# EAGLE schematic BT840_1.25mm_headers (EAGLE 9.6.2)

## Sheet 1 of 3
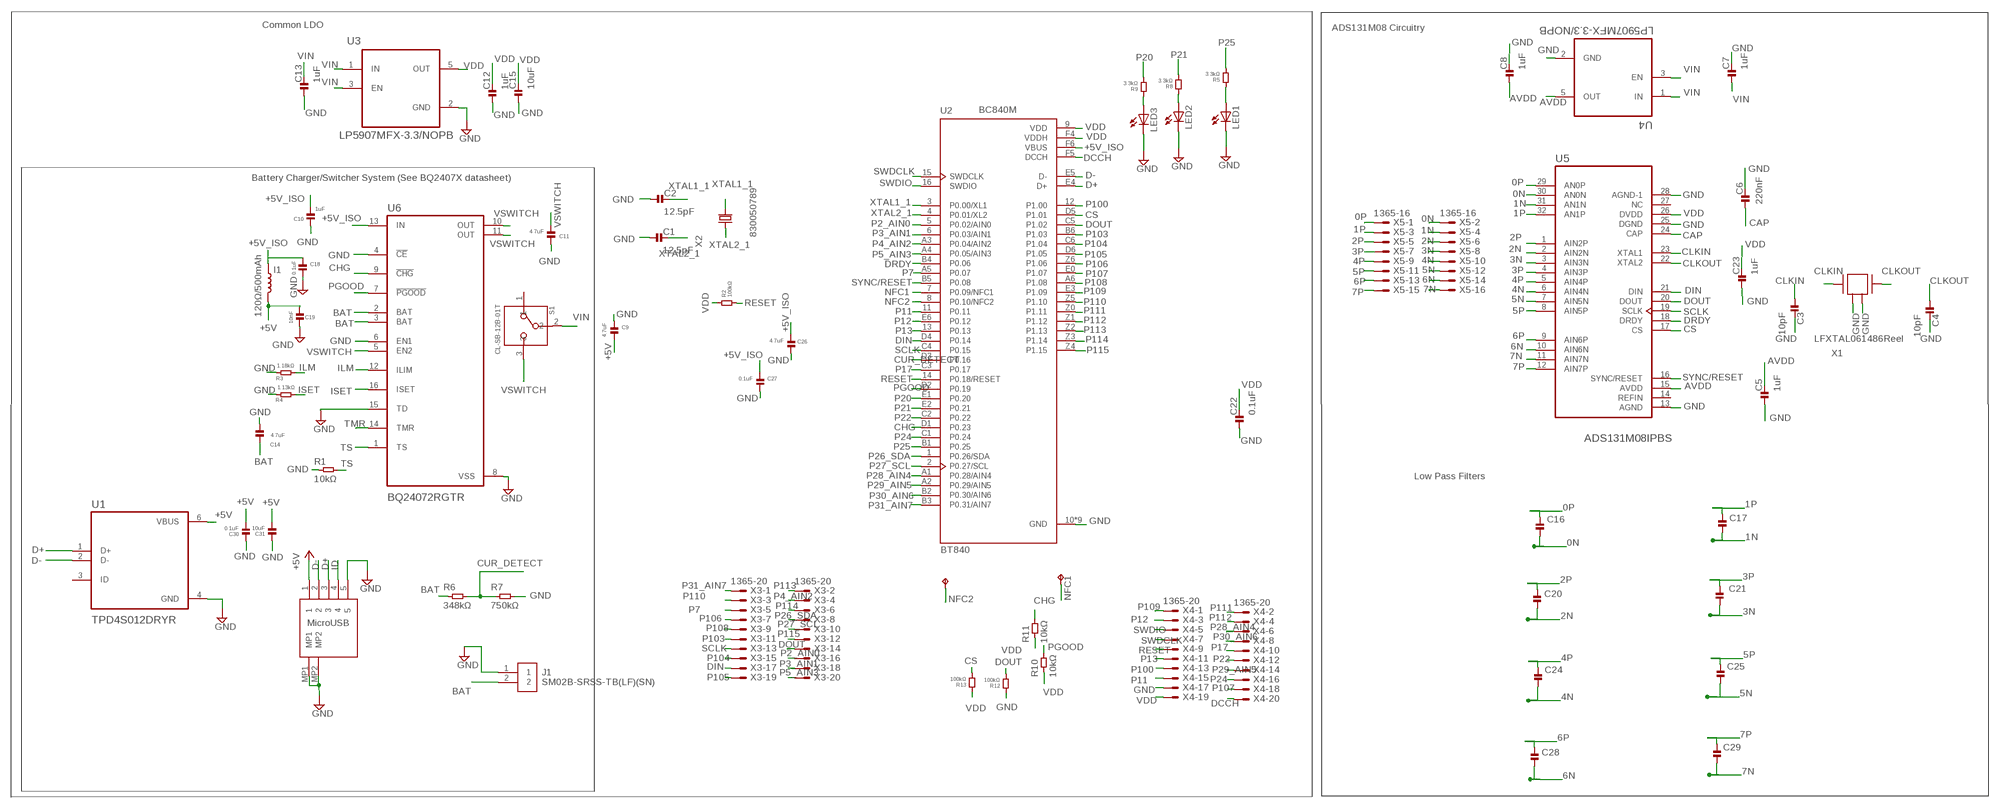
[diagram p0: schematic, sheet 1]

### Parts
C1  12.5pF  CAPACITOR.0201  [0201]
C2  12.5pF  CAPACITOR.0201  [0201]
C3  10pF  CAPACITOR.0201  [0201]
C4  10pF  CAPACITOR.0201  [0201]
C5  1uF  CAPACITOR.0201  [0201]
C6  220nF  CAPACITOR.0201  [0201]
C7  1uF  CAPACITOR.0201  [0201]
C8  1uF  CAPACITOR.0201  [0201]
C9  4.7uF  CAPACITOR.0201  [0201]
C10  1uF  CAPACITOR.0201  [0201]
C11  4.7uF  CAPACITOR.0201  [0201]
C12  1uF  CAPACITOR.0201  [0201]
C13  1uF  CAPACITOR.0201  [0201]
C14  4.7uF  CAPACITOR.0201  [0201]
C15  10uF  CAPACITOR.0402  [0402]
C16  100pF  CAPACITOR.0201  [0201]
C17  100pF  CAPACITOR.0201  [0201]
C18  0.1uF  CAPACITOR.0201  [0201]
C19  10nF  CAPACITOR.0201  [0201]
C20  100pF  CAPACITOR.0201  [0201]
C21  100pF  CAPACITOR.0201  [0201]
C22  0.1uF  CAPACITOR.0201  [0201]
C23  1uF  CAPACITOR.0201  [0201]
C24  100pF  CAPACITOR.0201  [0201]
C25  100pF  CAPACITOR.0201  [0201]
C26  4.7uF  CAPACITOR.0201  [0201]
C27  0.1uF  CAPACITOR.0201  [0201]
C28  100pF  CAPACITOR.0201  [0201]
C29  100pF  CAPACITOR.0201  [0201]
C30  0.1uF  CAPACITOR.0201  [0201]
C31  10uF  CAPACITOR.0402  [0402]
I1  120Ω/500mAh  12NH-0402  [0402_COILCRAFT]
J1  SM02B-SRSS-TB(LF)(SN)  [SM02B-SRSS-TB(LF)(SN)]
LED1  LEDCHIPLED_0603  [CHIPLED_0603]
LED2  LEDCHIPLED_0603  [CHIPLED_0603]
LED3  LEDCHIPLED_0603  [CHIPLED_0603]
NFC1  TPTP14SQ  [TP14SQ]
NFC2  TPTP14SQ  [TP14SQ]
R1  10kΩ  RESISTOR.0201  [0201]
R2  100kΩ  RESISTOR.0201  [0201]
R3  1.18kΩ  RESISTOR.0201  [0201]
R4  1.13kΩ  RESISTOR.0201  [0201]
R5  3.3kΩ  RESISTOR.0201  [0201]
R6  348kΩ  RESISTOR.0201  [0201]
R7  750kΩ  RESISTOR.0201  [0201]
R8  3.3kΩ  RESISTOR.0201  [0201]
R9  3.3kΩ  RESISTOR.0201  [0201]
R10  10kΩ  RESISTOR.0402  [0402]
R11  10kΩ  RESISTOR.0402  [0402]
R12  100kΩ  RESISTOR.0402  [0402]
R13  100kΩ  RESISTOR.0402  [0402]
S1  CL-SB-12B-01T  [CL-SB-12B]
U1  TPD4S012DRYR  [PSON50P145X100X60-6N]
U2  BT840  [XCVR_BT840]
U3  LP5907MFX-3.3/NOPB  [SOT95P280X145-5N]
U4  LP5907MFX-3.3/NOPB  [SOT95P280X145-5N]
U5  ADS131M08IPBS  [QFP50P700X700X120-32N]
U6  BQ24072RGTR  [QFN50P300X300X100-17N]
U7  DX4R005JJ2R1800  [DX4R005JJ2R1800]
X1  ABM3B-8.000MHZ-B2-T  [ABM3B-8.000MHZ-B2-T]
X2  FC-12M  [FC-12M]
X3  1365-20  [1365-20]
X4  1365-20  [1365-20]
X5  1365-16  [1365-16]

### Nets
0N: C16.2 U5.30(AN0N) X5.2
0P: C16.1 U5.29(AN0P) X5.1
1N: C17.2 U5.31(AN1N) X5.4
1P: C17.1 U5.32(AN1P) X5.3
2N: C20.2 U5.2(AIN2N) X5.6
2P: C20.1 U5.1(AIN2P) X5.5
3N: C21.2 U5.3(AIN3N) X5.8
3P: C21.1 U5.4(AIN3P) X5.7
4N: C24.2 U5.6(AIN4N) X5.10
4P: C24.1 U5.5(AIN4P) X5.9
5N: C25.2 U5.7(AIN5N) X5.12
5P: C25.1 U5.8(AIN5P) X5.11
6N: C28.2 U5.10(AIN6N) X5.14
6P: C28.1 U5.9(AIN6P) X5.13
7N: C29.2 U5.11(AIN7N) X5.16
7P: C29.1 U5.12(AIN7P) X5.15
+5V: C9.2 C19.2 C30.2 C31.2 I1.P$2 U1.6(VBUS) U7.1
+5V_ISO: C10.2 C18.1 C26.2 C27.2 I1.P$1 U2.F6(VBUS) U6.13(IN)
AVDD: C5.2 C8.1 U4.5(OUT) U5.15(AVDD)
BAT: C14.2 J1.2 R6.1 U6.2(BAT) U6.3(BAT)
CAP: C6.1 U5.24(CAP)
CHG: R11.2 U2.D1(P0.23) U6.9(!CHG)
CLKIN: C3.1 U5.23(XTAL1) X1.1
CLKOUT: C4.1 U5.22(XTAL2) X1.3
CS: R13.1 U2.D5(P1.01) U5.17(CS)
CUR_DETECT: R6.2 R7.1 U2.D3(P0.16)
D+: U1.1(D+) U2.E4(D+) U7.3
D-: U1.2(D-) U2.E5(D-) U7.2
DCCH: U2.F5(DCCH) X4.20
DIN: U2.D4(P0.14) U5.21(DIN) X3.17
DOUT: R12.1 U2.C5(P1.02) U5.20(DOUT) X3.14
DRDY: U2.B4(P0.06) U5.18(DRDY)
GND: C1.1 C2.1 C3.2 C4.2 C5.1 C6.2 C7.2 C8.2 C9.1 C10.1 C11.1 C12.1 C13.1 C14.1 C15.1 C18.2 C19.1 C22.1 C23.1 C26.1 C27.1 C30.1 C31.1 J1.1 LED1.C LED2.C LED3.C R1.1 R3.1 R4.1 R7.2 R12.2 U1.4(GND) U2.10(GND) U2.A0(GND) U2.B0(GND) U2.C0(GND) U2.D0(GND) U2.F0(GND) U2.F1(GND) U2.F2(GND) U2.F3(GND) U3.2(GND) U4.2(GND) U5.13(AGND) U5.25(DGND) U5.28(AGND-1) U6.4(!CE) U6.6(EN1) U6.8(VSS) U6.15(TD) U7.5 U7.MP1 U7.MP2 X1.2 X1.4 X4.17
ID: U7.4
ILM: R3.2 U6.12(ILIM)
ISET: R4.2 U6.16(ISET)
LED1: LED1.A R5.2
LED2: LED2.A R8.2
LED3: LED3.A R9.2
NFC1: NFC2.TP U2.7(P0.09/NFC1)
NFC2: NFC1.TP U2.8(P0.10/NFC2)
P2_AIN0: U2.5(P0.02/AIN0) X3.16
P3_AIN1: U2.6(P0.03/AIN1) X3.18
P4_AIN2: U2.A3(P0.04/AIN2) X3.4
P5_AIN3: U2.A4(P0.05/AIN3) X3.20
P7: U2.A5(P0.07) X3.5
P11: U2.11(P0.11) X4.15
P12: U2.E6(P0.12) X4.3
P13: U2.13(P0.13) X4.11
P17: U2.C3(P0.17) X4.10
P20: R9.1 U2.E1(P0.20)
P21: R8.1 U2.E2(P0.21)
P22: U2.C2(P0.22) X4.12
P24: U2.C1(P0.24) X4.16
P25: R5.1 U2.B1(P0.25)
P26_SDA: U2.1(P0.26/SDA) X3.8
P27_SCL: U2.2(P0.27/SCL) X3.10
P28_AIN4: U2.A1(P0.28/AIN4) X4.6
P29_AIN5: U2.A2(P0.29/AIN5) X4.14
P30_AIN6: U2.B2(P0.30/AIN6) X4.8
P31_AIN7: U2.B3(P0.31/AIN7) X3.1
P100: U2.12(P1.00) X4.13
P103: U2.B6(P1.03) X3.11
P104: U2.C6(P1.04) X3.15
P105: U2.D6(P1.05) X3.19
P106: U2.Z6(P1.06) X3.7
P107: U2.E0(P1.07) X4.18
P108: U2.A6(P1.08) X3.9
P109: U2.E3(P1.09) X4.1
P110: U2.Z5(P1.10) X3.3
P111: U2.Z0(P1.11) X4.2
P112: U2.Z1(P1.12) X4.4
P113: U2.Z2(P1.13) X3.2
P114: U2.Z3(P1.14) X3.6
P115: U2.Z4(P1.15) X3.12
PGOOD: R10.2 U2.D2(P0.19) U6.7(!PGOOD)
RESET: R2.1 U2.14(P0.18/RESET) X4.9
SCLK: U2.C4(P0.15) U5.19(SCLK) X3.13
SWDCLK: U2.15(SWDCLK) X4.7
SWDIO: U2.16(SWDIO) X4.5
SYNC/RESET: U2.B5(P0.08) U5.16(SYNC/RESET)
TMR: U6.14(TMR)
TS: R1.2 U6.1(TS)
VDD: C12.2 C15.2 C22.2 C23.2 R2.2 R10.1 R11.1 R13.2 U2.9(VDD) U2.F4(VDDH) U3.5(OUT) U5.26(DVDD) X4.19
VIN: C7.1 C13.2 S1.2 U3.1(IN) U3.3(EN) U4.1(IN) U4.3(EN)
VSWITCH: C11.2 S1.3 U6.5(EN2) U6.10(OUT) U6.11(OUT)
XTAL1_1: C2.2 U2.3(P0.00/XL1) X2.2
XTAL2_1: C1.2 U2.4(P0.01/XL2) X2.1
Unconnected: S1.1 U1.3(ID) U5.14(REFIN) U5.27(NC)

### Notes on the sheet
- Common LDO
- ADS131M08 Circuitry
- BC840M
- Battery Charger/Switcher System (See BQ2407X datasheet)
- 830050789
- LFXTAL061486Reel
- Low Pass Filters
- MicroUSB

## Sheet 2 of 3

## Sheet 3 of 3

## Library data of the parts
C1-C31 = standardparts:CAPACITOR
I1 = spkfncoils:12NH; MOUSER_PART: 994-0402HP-12NXGLU; PROD_ID: NDUC-15271; VALUE: 12nH
J1 = SM02B-SRSS-TB_LF__SN_:SM02B-SRSS-TB(LF)(SN): JST (JAPAN SOLDERLESS TERMINALS) - SM02B-SRSS-TB (LF)(SN) - HEADER, R/A, 2WAY Source: Datasheet <http://www.jst-mfg.com/product/pdf/eng/eSH.pdf> Check prices <https://pricing.snapeda.com/parts/SM02B-SRSS-TB%28LF%29%28SN%29/JST%20Sales/view-part?ref=eda>; AVAILABILITY: In Stock; DESCRIPTION: Connector Header Surface Mount, Right Angle 2 position 0.039 (1.00mm); MF: JST Sales; MP: SM02B-SRSS-TB(LF)(SN); PACKAGE: None; PRICE: None
LED1-LED3 = adafruit:LED: LED OSRAM: - CHIPLED LG R971, LG N971, LY N971, LG Q971, LY Q971, LO R971, LY R971 LH N974, LH R974 LS Q976, LO Q976, LY Q976 LO Q996 - Hyper CHIPLED LW Q18S LB Q993, LB Q99A, LB R99A - SideLED LS A670, LO A670, LY A670, LG A670, LP A670 LB A673, LV A673, LT A673, LW A673 LH A674 LY A675 LS A676, LA A676, LO A676, LY A676, LW A676 LS A679, LY A679, LG A679 - Hyper Micro SIDELED® LS Y876, LA Y876, LO Y876, LY Y876 LT Y87S - SmartLED LW L88C, LW L88S LB L89C, LB L89S, LG L890 LS L89K, LO L89K, LY L89K LS L896, LA L896, LO L896, LY L896 - TOPLED LS T670, LO T670, LY T670, LG T670, LP T670 LSG T670, LSP T670, LSY T670, LOP T670, LYG T670 LG T671, LOG T671, LSG T671 LB T673, LV T673, LT T673, LW T673 LH T674 LS T676, LA T676, LO T676, LY T676, LB T676, LH T676, LSB T676, LW T676 LB T67C, LV T67C, LT T67C, LS T67K, LO T67K, LY T67K, LW E67C LS E67B, LA E67B, LO E67B, LY E67B, LB E67C, LV E67C, LT E67C LW T67C LS T679, LY T679, LG T679 LS T770, LO T770, LY T770, LG T770, LP T770 LB T773, LV T773, LT T773, LW T773 LH T774 LS E675, LA E675, LY E675, LS T675 LS T776, LA T776, LO T776, LY T776, LB T776 LHGB T686 LT T68C, LB T68C - Hyper Mini TOPLED® LB M676 - Mini TOPLED Santana® LG M470 LS M47K, LO M47K, LY M47K Source: http://www.osram.convergy.de/
NFC1 NFC2 = testpad:TP: Test pad
R1 R2 R4-R13 = standardparts:RESISTOR
R3 = standardparts:RESISTOR; SPICEPREFIX: R
S1 = CL-SB-12B-01T:CL-SB-12B-01T: Check prices <https://pricing.snapeda.com/parts/CL-SB-12B-01T/Nidec%20Copal/view-part?ref=eda>; AVAILABILITY: In Stock; DESCRIPTION: Slide Switch SPDT Surface Mount; MF: Nidec Copal; MP: CL-SB-12B-01T; PACKAGE: None; PRICE: None
U1 = TPD4S012DRYR:TPD4S012DRYR: Check prices <https://pricing.snapeda.com/parts/TPD4S012DRYR/Texas%20Instruments/view-part?ref=eda>; AVAILABILITY: In Stock; DESCRIPTION: 4-channel USB ESD solution with power clamp 6-SON -40 to 85; MF: Texas Instruments; MP: TPD4S012DRYR; PACKAGE: USON-6 Texas Instruments; PRICE: None; PURCHASE-URL: https://pricing.snapeda.com/search/part/TPD4S012DRYR/?ref=eda
U2 = BT840:BT840: Bluetooth LE Module, Nordic nRF52840 SoC, Range 180 meters Check availability <https://pricing.snapeda.com/parts/BT840/Fanstel%20Corp./view-part?ref=eda>; AVAILABILITY: In Stock; DESCRIPTION: 802.15.4, Bluetooth Bluetooth v5.0, Thread, Zigbee® Transceiver Module 2.4GHz Antenna Not Included, U.FL Surface Mount; MF: Fanstel Corp.; MP: BT840; PACKAGE: SMD-16 Fanstel Corp.; PRICE: None; PURCHASE-URL: https://pricing.snapeda.com/search/part/BT840/?ref=eda
U3 U4 = LP5907MFX-3.3_NOPB:LP5907MFX-3.3/NOPB: IC REG LINEAR 3.3V 250MA SOT23; AVAILABILITY: Unavailable; DESCRIPTION: Linear Voltage Regulator IC 1 Output 250mA SOT-23-5; MF: Texas Instruments; MP: LP5907MFX-3.3/NOPB; PACKAGE: SOT-23 Texas Instruments; PRICE: None
U5 = ADS131M08IPBS:ADS131M08IPBS: None Check prices <https://pricing.snapeda.com/parts/ADS131M08IPBS/Texas%20Instruments/view-part?ref=eda>; AVAILABILITY: Warning; DESCRIPTION: 24-bit 32-kSPS 8-channelsimultaneous-sampling delta-sigma ADC 32-TQFP -40 to 125; MF: Texas Instruments; MP: ADS131M08IPBS; PACKAGE: TQFP-32 Texas Instruments; PRICE: None; PURCHASE-URL: https://pricing.snapeda.com/search/part/ADS131M08IPBS/?ref=eda
U6 = BQ24072RGTR:BQ24072RGTR: Check prices <https://pricing.snapeda.com/parts/BQ24072RGTR/Texas%20Instruments/view-part?ref=eda>; AVAILABILITY: In Stock; DESCRIPTION: Standalone 1-cell 1.5-A linear charger, Power Path, 4.2-V VBAT and VOUT=VBAT + 225mV 16-VQFN -40 to 85; MF: Texas Instruments; MP: BQ24072RGTR; PACKAGE: VQFN-16 Texas Instruments; PRICE: None; PURCHASE-URL: https://pricing.snapeda.com/search/part/BQ24072RGTR/?ref=eda
U7 = DX4R005JJ2R1800:DX4R005JJ2R1800: Check prices <https://pricing.snapeda.com/parts/DX4R005JJ2R1800/JAE%20Electronics/view-part?ref=eda>; AVAILABILITY: In Stock; DESCRIPTION: USB - micro B USB 2.0 Receptacle Connector 5 Position Surface Mount, Right Angle; Through Hole; MF: JAE Electronics; MP: DX4R005JJ2R1800; PACKAGE: None; PRICE: None
X1 = Crystals_Oscillators:ABM3B-8.000MHZ-B2-T: CRYSTAL 8.0000MHZ 18PF SMD Manufacturer's datasheet <https://abracon.com/Resonators/abm3b.pdf>; CREATED_BY: PCBLayout.com; DIGIKEY_PART_NUMBER: 535-9720-2-ND; MANUFACTURER: Abracon LLC; MPN: ABM3B-8.000MHZ-B2-T; PACKAGE: SMD 4
X2 = crystal:FC-12M: kHz RANGE CRYSTAL UNIT LOW PROFILE SMD Source: Epson Toyocom FC-12M.pdf
X3 X4 = con-leotronics:1365-20: DUAL ROW STRAIGHT HEADER 1364 SERIES. 1.27mm x 1.27mm. Without Fixing Post. SMT Source: http://www.leotronics.co.uk/Conexcon/Data%20Sheets/sec.%20A/1364ing.pdf; OC_FARNELL: unknown; OC_NEWARK: unknown
X5 = con-leotronics:1365-16: DUAL ROW STRAIGHT HEADER 1364 SERIES. 1.27mm x 1.27mm. Without Fixing Post. SMT Source: http://www.leotronics.co.uk/Conexcon/Data%20Sheets/sec.%20A/1364ing.pdf; OC_FARNELL: unknown; OC_NEWARK: unknown